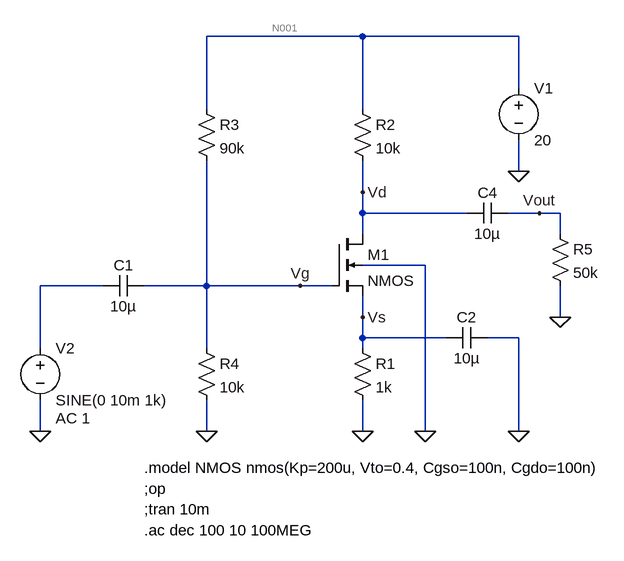
[diagram p0: schematic Amplifier.asc]
Amplifier.asc, the LTspice schematic file:
Version 4
SHEET 1 880 680
WIRE 224 -160 -16 -160
WIRE 464 -160 224 -160
WIRE 464 -80 464 -160
WIRE -16 -48 -16 -160
WIRE 224 -48 224 -160
WIRE 464 48 464 0
WIRE 224 80 224 32
WIRE 224 112 224 80
WIRE 384 112 224 112
WIRE 496 112 448 112
WIRE 528 112 496 112
WIRE 224 144 224 112
WIRE 528 144 528 112
WIRE 320 192 224 192
WIRE -176 224 -272 224
WIRE -16 224 -16 32
WIRE -16 224 -112 224
WIRE 128 224 -16 224
WIRE 176 224 128 224
WIRE 224 272 224 240
WIRE 528 272 528 224
WIRE 224 304 224 272
WIRE 352 304 224 304
WIRE 464 304 416 304
WIRE -272 320 -272 224
WIRE -16 320 -16 224
WIRE 224 320 224 304
WIRE -272 448 -272 400
WIRE -16 448 -16 400
WIRE 224 448 224 400
WIRE 320 448 320 192
WIRE 464 448 464 304
FLAG -16 448 0
FLAG 224 448 0
FLAG 464 48 0
FLAG 320 448 0
FLAG -272 448 0
FLAG 464 448 0
FLAG 528 272 0
FLAG 224 80 Vd
FLAG 128 224 Vg
FLAG 224 272 Vs
FLAG 496 112 Vout
SYMBOL nmos4 176 144 R0
SYMATTR InstName M1
SYMATTR Value2 l=0.1u w=25u
SYMBOL res 208 304 R0
SYMATTR InstName R1
SYMATTR Value 1k
SYMBOL res 208 -64 R0
SYMATTR InstName R2
SYMATTR Value 10k
SYMBOL res -32 -64 R0
SYMATTR InstName R3
SYMATTR Value 90k
SYMBOL res -32 304 R0
SYMATTR InstName R4
SYMATTR Value 10k
SYMBOL voltage 464 -96 R0
WINDOW 123 0 0 Left 0
WINDOW 39 0 0 Left 0
SYMATTR InstName V1
SYMATTR Value 20
SYMBOL cap -176 240 R270
WINDOW 0 32 32 VTop 2
WINDOW 3 0 32 VBottom 2
SYMATTR InstName C1
SYMATTR Value 10µ
SYMBOL voltage -272 304 R0
WINDOW 123 24 124 Left 2
WINDOW 39 0 0 Left 0
SYMATTR InstName V2
SYMATTR Value SINE(0 10m 1k)
SYMATTR Value2 AC 1
SYMBOL cap 416 288 R90
WINDOW 0 0 32 VBottom 2
WINDOW 3 32 32 VTop 2
SYMATTR InstName C2
SYMATTR Value 10µ
SYMBOL cap 448 96 R90
WINDOW 0 0 32 VBottom 2
WINDOW 3 32 32 VTop 2
SYMATTR InstName C4
SYMATTR Value 10µ
SYMBOL res 512 128 R0
SYMATTR InstName R5
SYMATTR Value 50k
TEXT -112 504 Left 2 !.model NMOS nmos(Kp=200u, Vto=0.4, Cgso=100n, Cgdo=100n)
TEXT -112 536 Left 2 !;op
TEXT -112 568 Left 2 !;tran 10m
TEXT -112 600 Left 2 !.ac dec 100 10 100MEG

The netlist it stands for:
* Amplifier.asc
M1 Vd Vg Vs 0 NMOS l=0.1u w=25u
R1 Vs 0 1k
R2 N001 Vd 10k
R3 N001 Vg 90k
R4 Vg 0 10k
V1 N001 0 20
C1 N002 Vg 10µ
V2 N002 0 SINE(0 10m 1k) AC 1
C2 0 Vs 10µ
C4 Vout Vd 10µ
R5 Vout 0 50k
.model NMOS NMOS
.model PMOS PMOS
.lib standard.mos
.model NMOS nmos(Kp=200u, Vto=0.4, Cgso=100n, Cgdo=100n)
;op
;tran 10m
.ac dec 100 10 100MEG
.backanno
.end

* Results of the author's LTspice run, read from the files saved beside the schematic
* Operating Point, zero values left out:
*   V(vd) = 6.338 V
*   V(vg) = 2 V
*   V(vs) = 1.366 V
*   V(n001) = 20 V
*   Id(M1) = 1.366 mA
*   Ib(M1) = -7.724 pA
*   Is(M1) = -1.366 mA
*   I(R4) = 200 µA
*   I(R3) = 200 µA
*   I(R2) = 1.366 mA
*   I(R1) = 1.366 mA
*   I(V1) = -1.566 mA
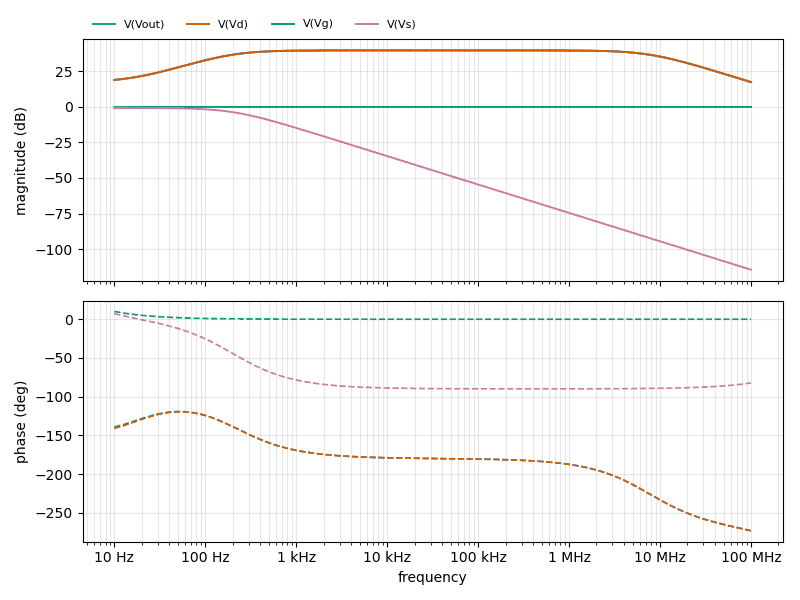
[diagram p1: AC Analysis of Amplifier.asc, plotted from the saved traces]
* AC Analysis, 1 run:
*   V(Vout): 19.00 dB at 10 Hz, 17.49 dB at 100 MHz, peak 39.77 dB at 38.9 kHz, 3 dB below the peak at 200.7 Hz and 7.64 MHz
*   V(Vd): 19.01 dB at 10 Hz, 17.49 dB at 100 MHz, peak 39.77 dB at 38.9 kHz, 3 dB below the peak at 200.7 Hz and 7.64 MHz
*   V(Vg): -0.13 dB at 10 Hz, -0.00 dB at 100 MHz, peak -0.00 dB at 100 MHz
*   V(Vs): -0.86 dB at 10 Hz, -114.53 dB at 100 MHz, peak -0.79 dB at 19.05 Hz, 3 dB below the peak at 205.4 Hz